# EAGLE design Voltera_Punk_Console (EAGLE 6.6.0)
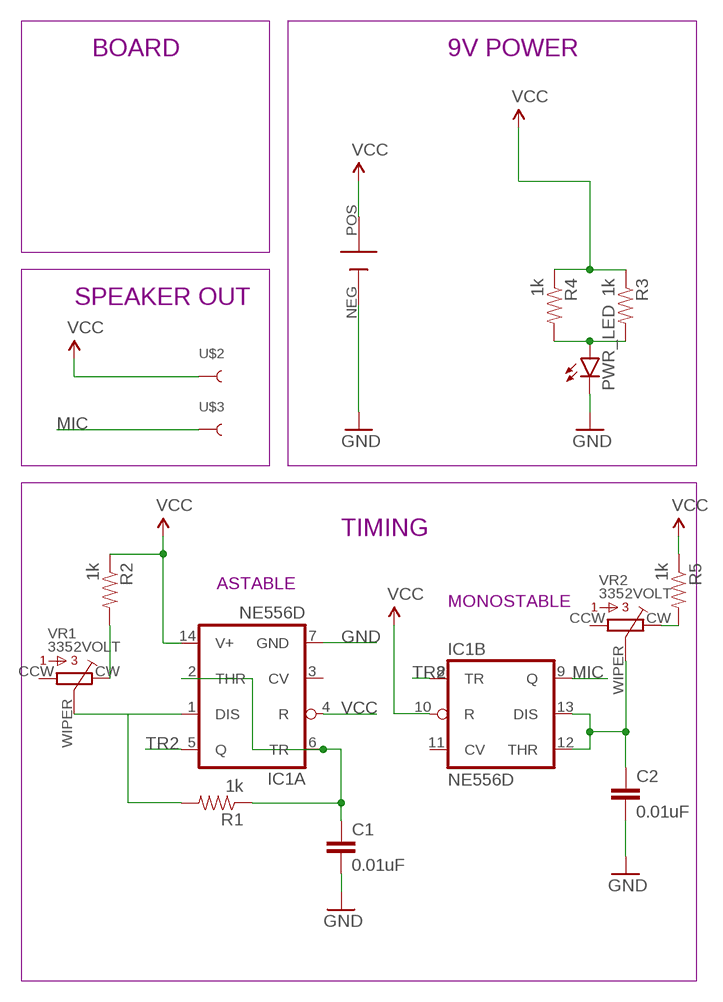
[diagram p0: schematic, sheet 1]

## Parts
C1  0.01uF  CAP1206  [1206]
C2  0.01uF  CAP1206  [1206]
IC1  NE556D  [SO14]
PWR_LED  LED1206  [LED-1206]
R1  1k  RESISTOR1206  [1206]
R2  1k  RESISTOR1206  [1206]
R3  1k  RESISTOR1206  [1206]
R4  1k  RESISTOR1206  [1206]
R5  1k  RESISTOR1206  [1206]
U$2  VOLT_RIVET1MM  [VOLT_RIVET_1MM]
U$3  VOLT_RIVET1MM  [VOLT_RIVET_1MM]
U$4  SMD_BATTERY_9VVIA  [VIA_BATTERY_PADS]
VR1  3352VOLT  [3352E_VOLT_VIA]
VR2  3352VOLT  [3352E_VOLT_VIA]

## Nets
GND: C1.2 C2.2 IC1.7(A:GND) PWR_LED.C U$4.NEG
MIC: IC1.9(B:Q) U$3.P$1
N$1: PWR_LED.A R3.2 R4.2
N$7: IC1.1(A:DIS) R1.2 VR1.WIPER
N$15: R2.2 VR1.CW
N$16: R5.2 VR2.CW
THR1: C1.1 IC1.2(A:THR) IC1.6(A:TR) R1.1
THR2: C2.1 IC1.12(B:THR) IC1.13(B:DIS) VR2.WIPER
TR2: IC1.5(A:Q) IC1.8(B:TR)
VCC: IC1.4(A:R) IC1.10(B:R) IC1.14(A:V+) R2.1 R3.1 R4.1 R5.1 U$2.P$1 U$4.POS
Unconnected: IC1.3(A:CV) IC1.11(B:CV) VR1.CCW VR2.CCW

## Notes on the sheet
- BOARD | 9V POWER
- SPEAKER OUT
- TIMING
- ASTABLE
- MONOSTABLE

## Library data of the parts
C1 C2 = SparkFun-Capacitors:CAP: Capacitor Standard 0603 ceramic capacitor, and 0.1" leaded capacitor.
IC1 = linear:*556: Dual TIMER
PWR_LED = SparkFun-LED:LED: LEDs Standard schematic elements and footprints for 5mm, 3mm, 1206, and 0603 sized LEDs. 5mm - Spark Fun Electronics SKU : COM-00529 (and others)
R1-R5 = SparkFun-Resistors:RESISTOR: Resistor Basic schematic elements and footprints for 0603, 1206, and PTH resistors.
U$2 U$3 = voltera:VOLT_RIVET
U$4 = voltera:SMD_BATTERY_9V
VR1 VR2 = bourns:3352

## Board
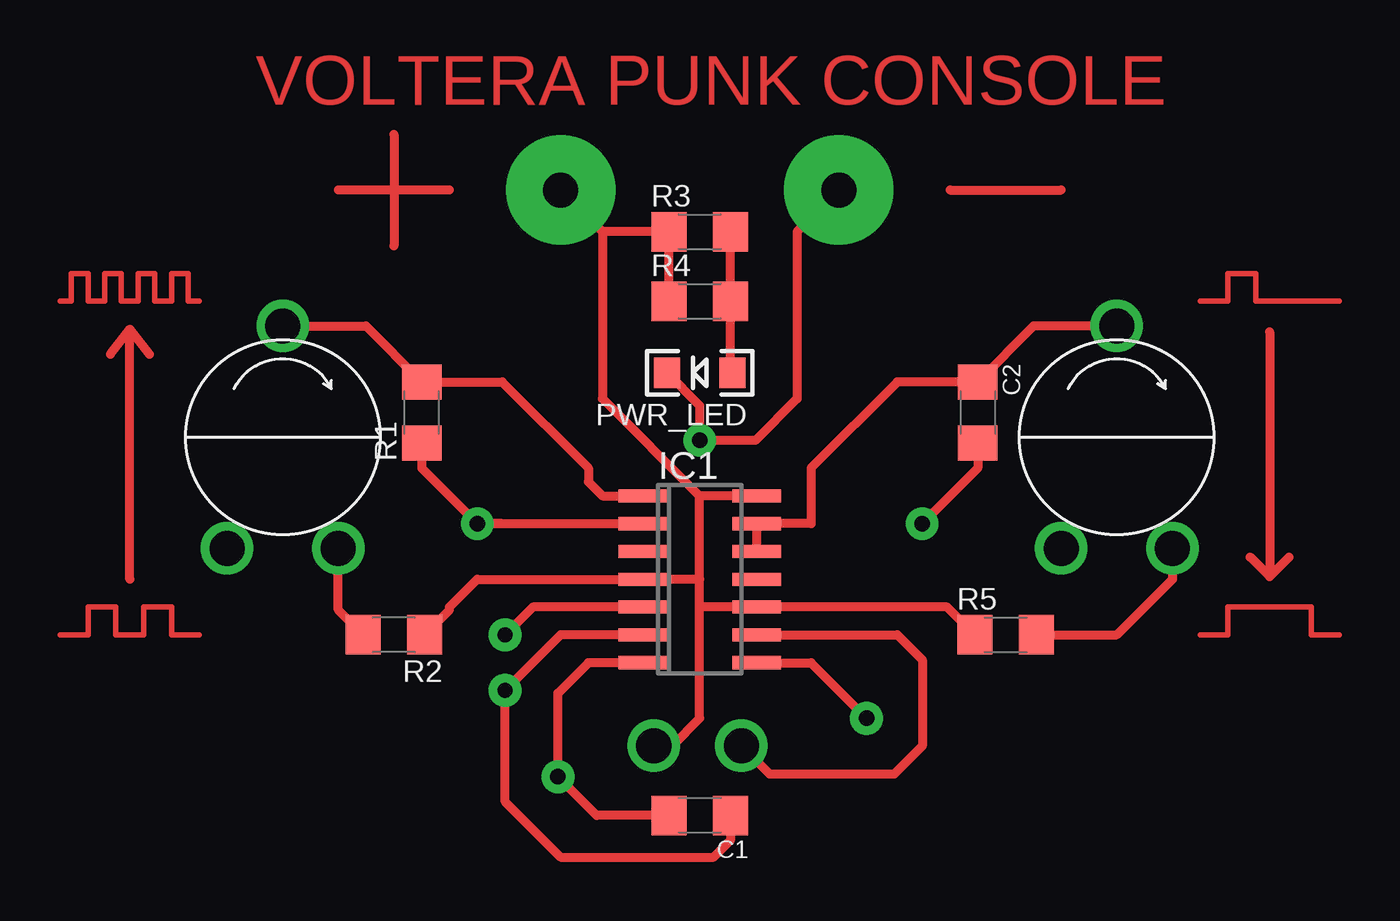
[diagram p1: board, top side]
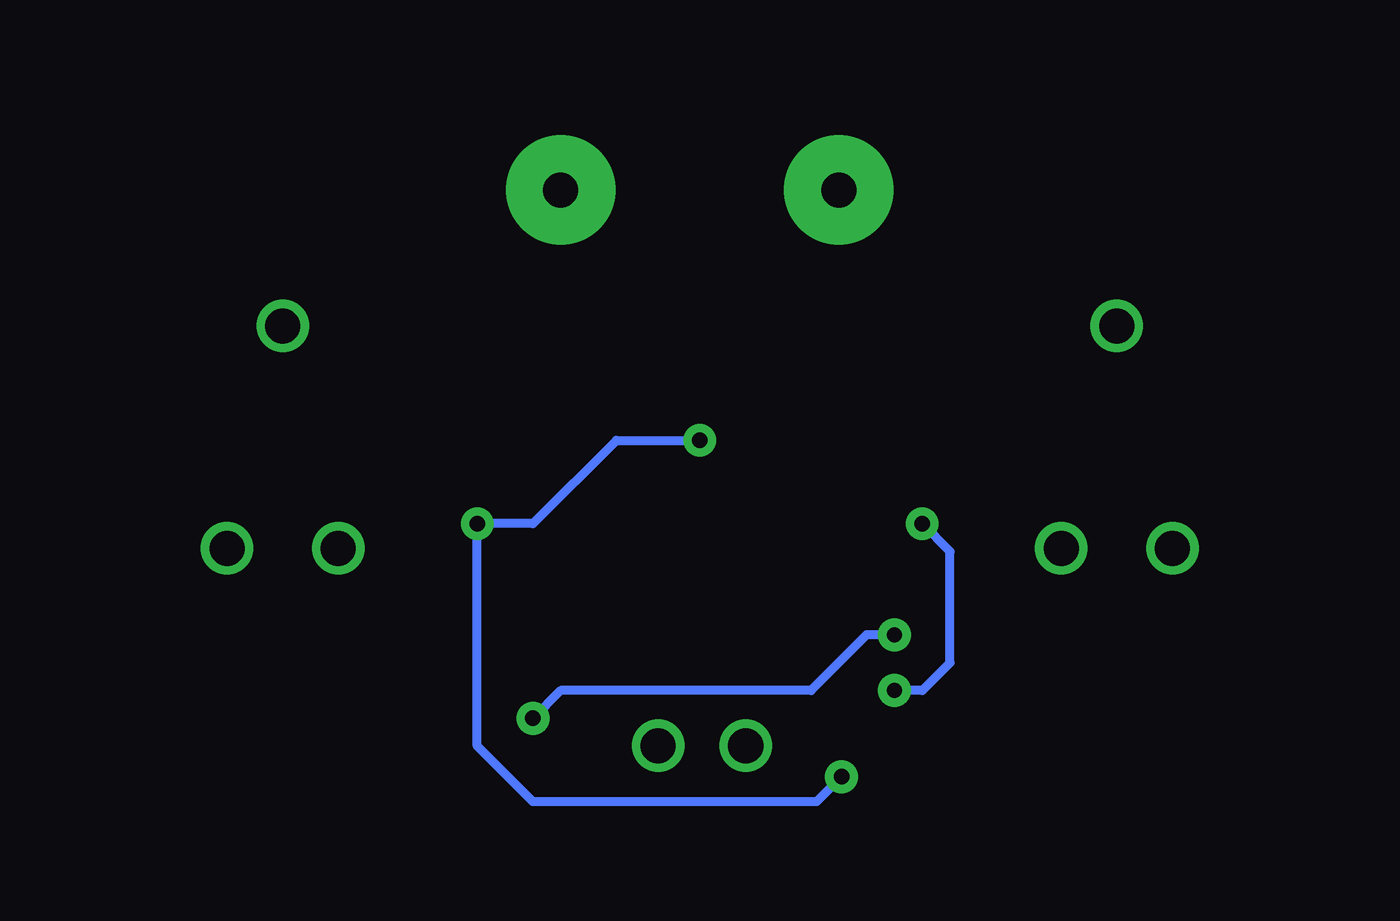
[diagram p2: board, bottom side, seen from below]

No outline drawn. Coordinates in mm, seen from the top.
Copper layers (1*16): Top 0.035mm / dielectric 1.5mm / Bottom 0.035mm
Design rules "default": minimum track width 10mil, minimum drill 24mil, track to track 8mil, track to pad 8mil, pad to pad 8mil, via to via 8mil, smd to smd 8mil, copper to edge 40mil, drill to drill 8mil, minimum pad ring 10mil, minimum via ring 8mil, stop-mask expansion 4mil, vias tented up to drill 0mil, thermal gap 10mil

### Footprints (pad centres in the part's own frame; a part is rotated, then mirrored left to right if it is on the bottom)
1206 = smd 1.6 x 1.8: 1 -1.4,0; 2 1.4,0
SO14 = smd 0.6 x 2.2: 1 -3.81,-2.6; 2 -2.54,-2.6; 3 -1.27,-2.6; 4 0,-2.6; 5 1.27,-2.6; 6 2.54,-2.6; 7 3.81,-2.6; 8 3.81,2.6; 9 2.54,2.6; 10 1.27,2.6; 11 0,2.6; 12 -1.27,2.6; 13 -2.54,2.6; 14 -3.81,2.6
LED-1206 = smd 1.2 x 1.4: A -1.5,0; C 1.5,0
VOLT_RIVET_1MM = drill 1.6 pad 2.4: P$1 0,0
VIA_BATTERY_PADS = drill 1.6 pad 5: NEG -6.35,0; POS 6.35,0
3352E_VOLT_VIA = drill 1.6 pad 2.4: CCW -2.54,-5.08; CW 2.54,-5.08; WIPER 0,5.08

### Placement (x,y rotation side)
C1  38.1,8.26 180 top
C2  50.8,26.67 270 top
IC1  38.1,19.05 270 top
PWR_LED  38.1,28.48 180 top
R1  25.4,26.67 90 top
R2  24.13,16.51 180 top
R3  38.1,34.92 0 top
R4  38.1,31.75 0 top
R5  52.07,16.51 0 top
U$2  36,11.45 90 top
U$3  40,11.45 90 top
U$4  38.1,36.83 180 top
VR1  19.05,25.54 0 top
VR2  57.15,25.54 0 top

### Tracks (layer width: path | path; a pad name or v marks a point on that pad's centre or on a via)
GND  (via drill 0.7 pad 1.5)
  Top 0.406: 35.56,15.18 IC1.7 33.02,15.24 31.62,13.84 v31.62,10.03 33.4,8.26 C1.2 | PWR_LED.C 38.1,26.98 v38.1,25.4 40.64,25.4 42.55,27.3 42.55,34.92 U$4.NEG | C2.2 50.8,24.13 v48.26,21.59
  Bottom 0.406: v38.1,25.4 41.91,25.4 45.72,21.59 v48.26,21.59 48.26,11.43 45.72,8.89 32.76,8.89 v31.62,10.03
MIC
  Top 0.406: IC1.9 47.12,16.51 48.26,15.37 48.26,11.43 46.99,10.16 41.28,10.16 U$3.P$1
N$1
  Top 0.406: R3.2 R4.2 39.5,28.59 PWR_LED.A
N$2
  Top 0.406: 49.53,36.83 54.61,36.83
N$3
  Top 0.406: 26.67,36.83 21.59,36.83
N$4
  Top 0.406: 24.13,39.37 24.13,34.29
N$6
  Top 0.406: 12.06,19.05 12.06,30.48 | 12.06,30.48 11.18,29.34 | 12.06,30.48 12.95,29.34
N$7
  Top 0.406: 35.56,22.92 IC1.1 33.66,22.86 33.02,23.5 33.02,24.13 29.08,28.07 R1.2 22.85,30.62 VR1.WIPER
N$8
  Top 0.254: 8.89,31.75 9.4,31.75 9.4,33.02 10.16,33.02 10.16,31.75 10.92,31.75 10.92,33.02 11.68,33.02 11.68,31.75 12.45,31.75 12.45,33.02 13.21,33.02 13.21,31.75 13.97,31.75 13.97,33.02 14.73,33.02 14.73,31.75 15.24,31.75
N$9
  Top 0.254: 60.96,16.51 62.23,16.51 62.23,17.78 66.04,17.78 66.04,16.51 67.31,16.51
N$12
  Top 0.406: 64.14,30.35 64.14,19.18 | 64.14,19.18 65.02,20.07 | 64.14,19.18 63.25,20.07
N$13
  Top 0.254: 60.96,31.75 62.23,31.75 62.23,33.02 63.5,33.02 63.5,31.75 67.31,31.75
N$14
  Top 0.254: 8.89,16.51 10.16,16.51 10.16,17.78 11.43,17.78 11.43,16.51 12.7,16.51 12.7,17.78 13.97,17.78 13.97,16.51 15.24,16.51
N$15
  Top 0.406: R2.2 21.59,17.65 VR1.CW
N$16
  Top 0.406: VR2.CW 59.69,19.05 57.15,16.51 R5.2
THR1  (via drill 0.7 pad 1.5)
  Top 0.406: v27.94,21.59 IC1.2 | IC1.6 31.75,16.51 v29.21,13.97 29.21,8.89 31.75,6.35 38.73,6.35 39.5,7.12 C1.1 | 29.08,21.59 v27.94,21.59 | R1.1 25.4,24.13 v27.94,21.59
  Bottom 0.406: v29.21,13.97 27.94,13.97 26.67,15.24 26.67,20.32 v27.94,21.59
THR2
  Top 0.406: IC1.13 43.18,21.59 43.18,24.13 47.12,28.07 C2.1 53.35,30.62 VR2.WIPER | 40.64,21.59 IC1.13 | IC1.13 IC1.12
TR2  (via drill 0.7 pad 1.5)
  Top 0.406: IC1.8 43.18,15.24 v45.72,12.7 | IC1.5 30.48,17.78 v29.21,16.51
  Bottom 0.406: v45.72,12.7 44.45,13.97 33.02,13.97 30.48,16.51 v29.21,16.51
VCC
  Top 0.406: 38.1,17.78 IC1.10 49.4,17.78 R5.1 | 38.1,17.78 38.1,19.05 | 38.1,19.05 IC1.4 27.94,19.05 26.67,17.78 26.67,17.65 R2.1 | 38.1,17.78 38.1,12.7 36.84,11.45 U$2.P$1 | 38.1,19.05 38.1,22.86 | IC1.14 38.1,22.86 | 33.66,34.92 R3.1 R4.1 | 33.66,34.92 U$4.POS | 33.66,34.92 33.66,27.3 38.1,22.86

### Text on the board
Top: VOLTERA PUNK CONSOLE